# Altium schematic sheet 02_ RF & Power.SchDoc: EFR32FG28 Diversity Board with discrete matching network for 868/915 MHz
size 420 x 297 mm; Doc: BRD4210C; OrgName: Silicon Labs; Page Number: 2; Page Title: RF & Power; Page Size: A3; Page Count: 4; Board Designer: MSZ; RevCode: A00; DsnPath: C:\Users\maszvobo\Downloads\BRD4210A-A01-schematic-dsn\BRD4210A.DSN; SchematicName: SCHEMATIC1; PageName: 02: RF & Power; PageSize: A3; TopSchematic: True
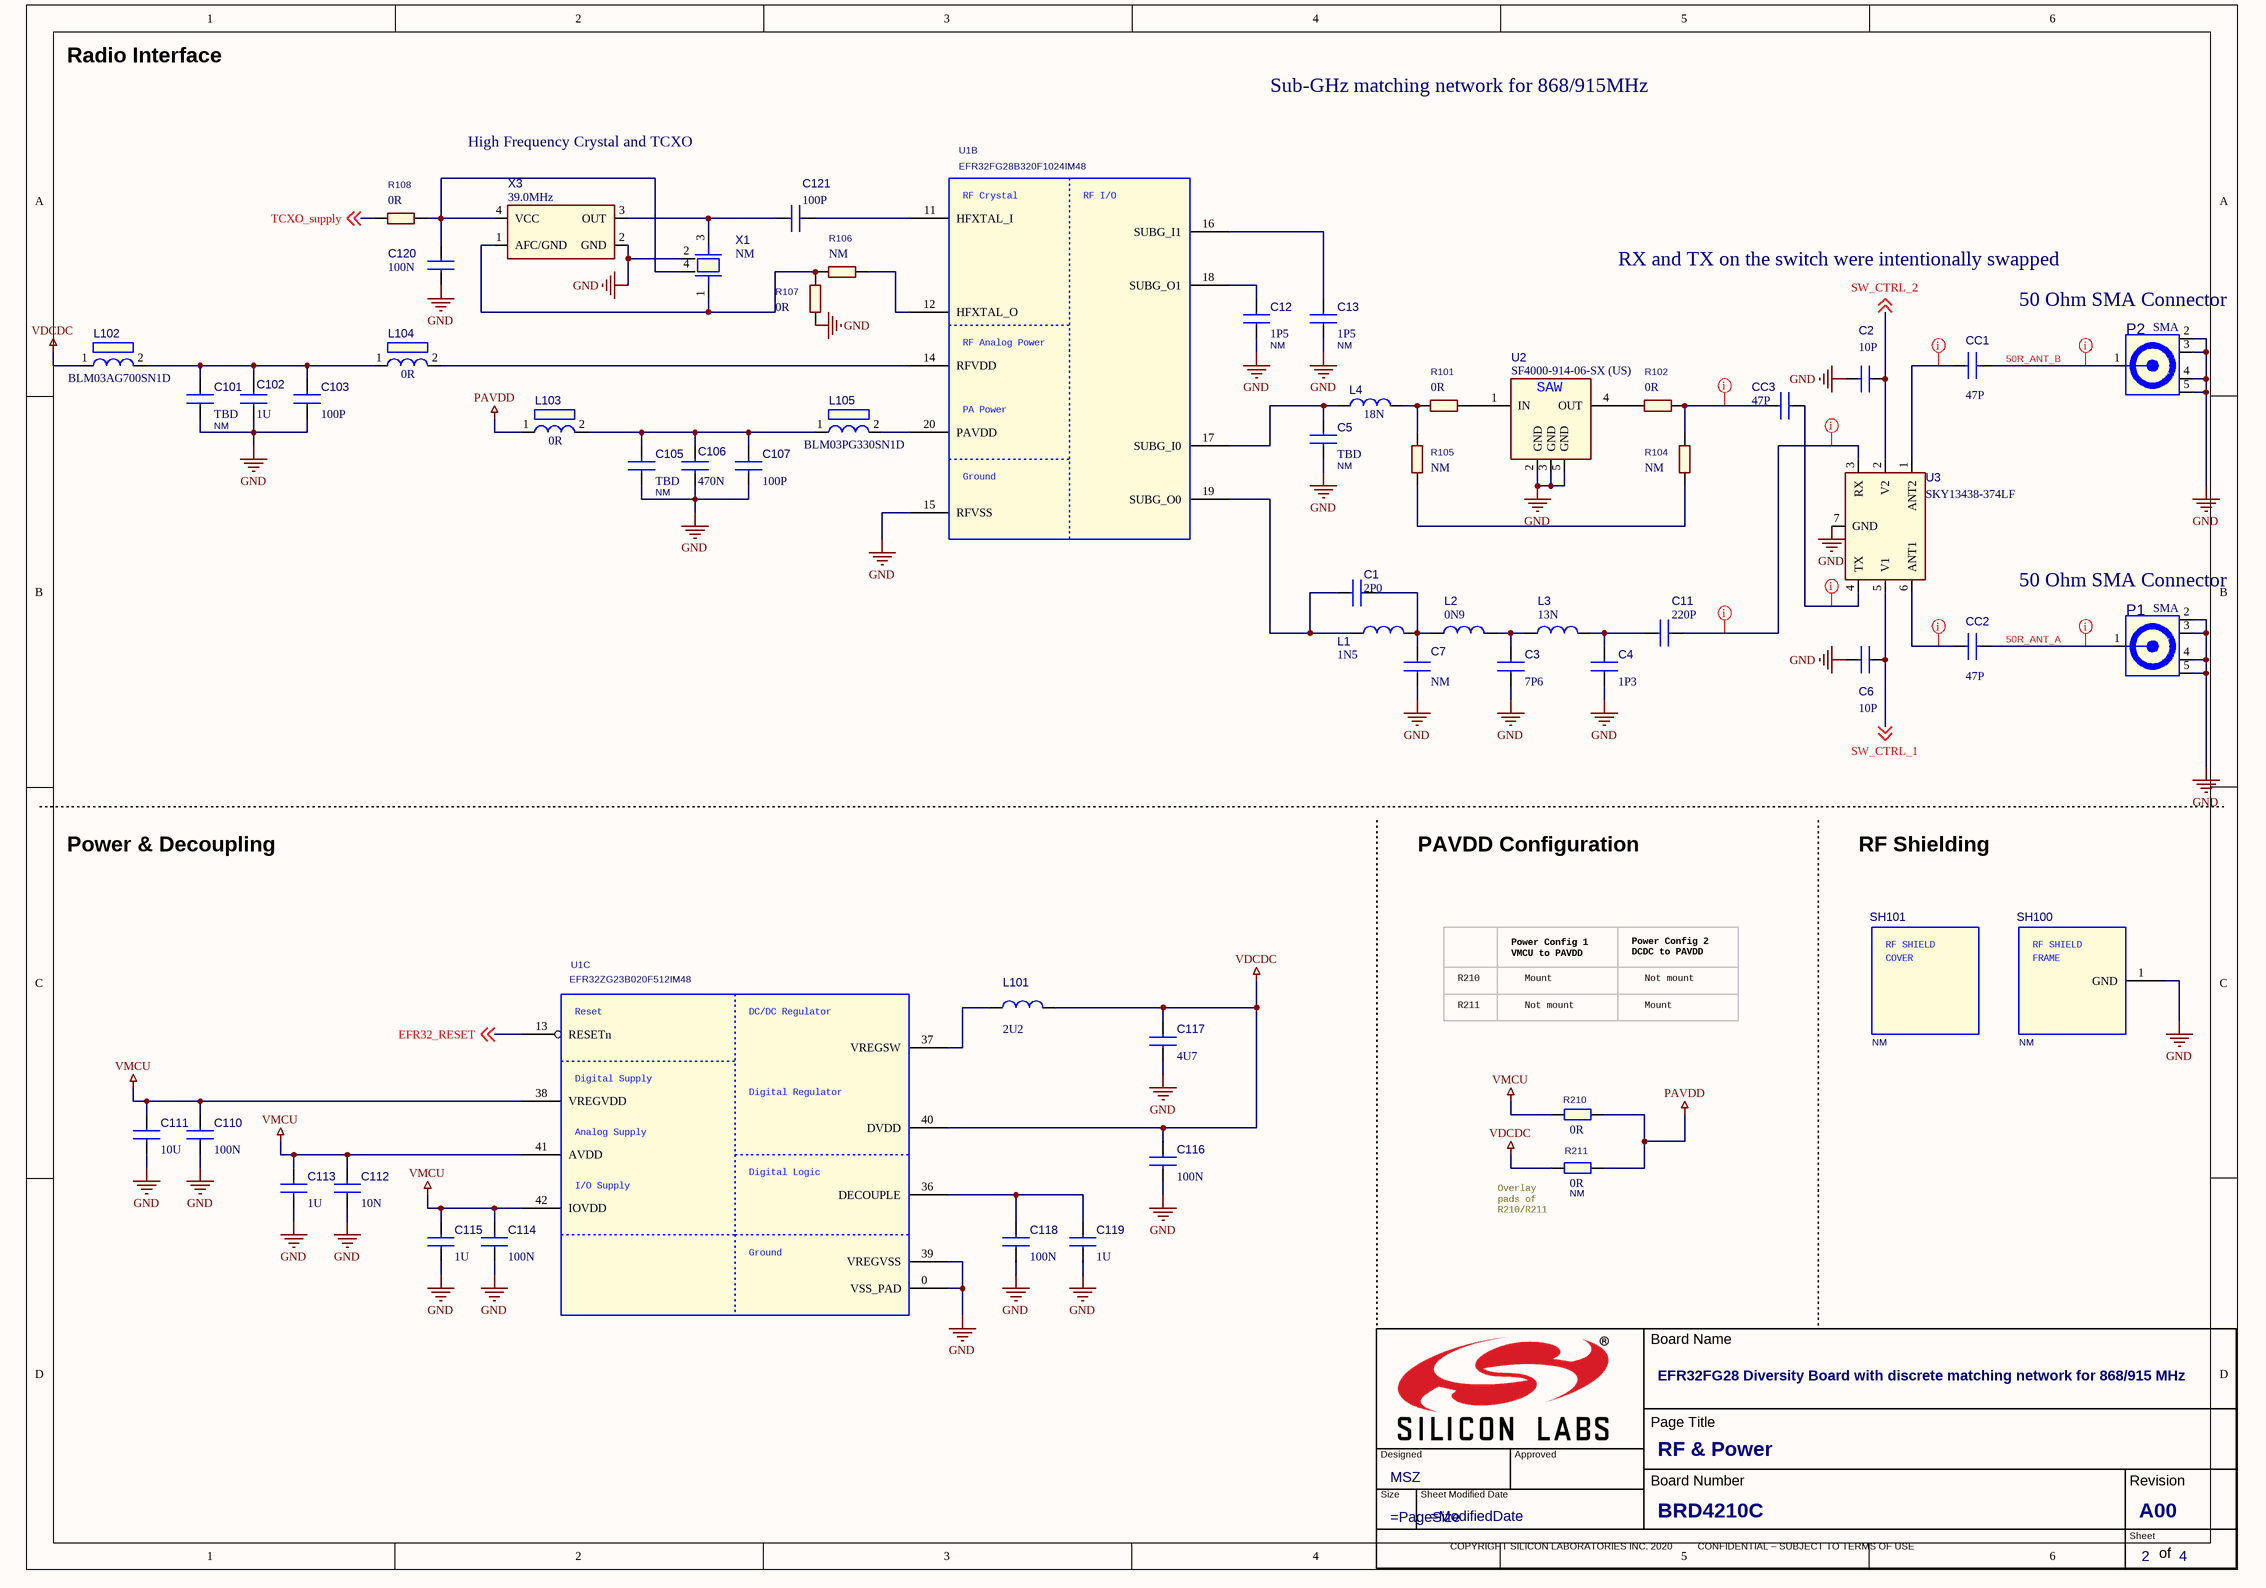
[diagram p0: 02_ RF & Power.SchDoc]

## Parts
*  Doc: BRD4210C  RevCode: A00  Board Designer: MSZ  Page Title: RF & Power  Page Number: 2  Page Count: 4  Title: EFR32FG28 Diversity Board with discrete matching network for 868/915 MHz  (graphical)
C1  2P0  [C0201_L]
C2  10P  [C0201_L]
C3  7P6  [C0201_L]
C4  1P3  [C0201_L]
C5  TBD  Not Mounted: NM  [C0201_L]
C6  10P  [C0201_L]
C7  NM  [C0201_L]
C11  220P  [C0201_L]
C12  1P5  Not Mounted: NM  [C0201_L]
C13  1P5  Not Mounted: NM  [C0201_L]
C101  TBD  Not Mounted: NM  [C0201_L]
C102  1U  [C0402_L]
C103  100P  [C0201_L]
C105  TBD  Not Mounted: NM  [C0201_L]
C106  470N  [C0402_L]
C107  100P  [C0201_L]
C110  100N  [C0201_L]
C111  10U  [C0603_L]
C112  10N  [C0201_L]
C113  1U  [C0402_L]
C114  100N  [C0201_L]
C115  1U  [C0402_L]
C116  100N  [C0201_L]
C117  4U7  [C0603_L]
C118  100N  [C0201_L]
C119  1U  [C0402_L]
C120  100N  [C0201_L]
C121  100P  [C0201_L]
CC1  47P  [C0201_L]
CC2  47P  [C0201_L]
CC3  47P  [C0201_L]
L1  1N5  [COIL_0201_L]
L2  0N9  [COIL_0201_L]
L3  13N  [COIL_0201_L]
L4  18N  [COIL_0201_L]
L101  2U2  [COIL_1008_L]
L102  BLM03AG700SN1D  [COIL_MUR_BLM03_0201]
L103  0R  [COIL_MUR_BLM03_0201]
L104  0R  [COIL_MUR_BLM03_0201]
L105  BLM03PG330SN1D  [COIL_MUR_BLM03_0201]
P1  SMA  [TE_SMA_1814832_TH_VER]
P2  SMA  [TE_SMA_1814832_TH_VER]
R101  0R  [R0201_L]
R102  0R  [R0201_L]
R104  NM  [R0201_L]
R105  NM  [R0201_L]
R106  NM  [R0201_L]
R107  0R  [R0201_L]
R108  0R  [R0201_L]
R210  0R  [R0402_L]
R211  0R  Not Mounted: NM  [R0402_L]
SH100  Not Mounted: NM  [Shield_21x21mm]  (hidden comment: RF_SHIELD_FRAME_36103205S)
SH101  Not Mounted: NM  (hidden comment: RF_SHIELD_COVER_36003200S)
U1  EFR32FG28B320F1024IM48  [QFN48_M040_6.0X6.0_EP_SL]  (parts B,C of 3)
U2  SF4000-914-06-SX (US)  [SF1256]
U3  SKY13438-374LF  [SKY13438-374LF]
X1  NM  [X_SSS_DSX211SH_2.05X1.65-4]
X3  39.0MHz  [TCXO_7Z-38.400MBG-T_SMD2016_TXC]

## Nets
GND: C2.1 C3.2 C4.2 C5.2 C6.1 C7.2 C12.2 C13.2 C101.2 C102.2 C103.2 C105.2 C106.2 C107.2 C110.2 C111.2 C112.2 C113.2 C114.2 C115.2 C116.2 C117.2 C118.2 C119.2 C120.2 P1.2(GND1) P1.3(GND2) P1.4(GND3) P1.5(GND4) P2.2(GND1) P2.3(GND2) P2.4(GND3) P2.5(GND4) R107.2 SH100.1(GND) U1.0(VSS_PAD) U1.15(RFVSS) U1.39(VREGVSS) U2.2(GND) U2.3(GND) U2.5(GND) U3.7(GND) X1.2 X3.2(GND)
PAVDD: L103.1 R210.1 R211.2
VDCDC: C116.1 C117.1 L101.2 L102.1 R211.1 U1.40(DVDD)
VMCU: C110.1 C111.1 C112.1 C113.1 C114.1 C115.1 R210.2 U1.38(VREGVDD) U1.41(AVDD) U1.42(IOVDD)
50R_ANT_A: CC2.2 P1.1(SIGNAL)
50R_ANT_B: CC1.2 P2.1(SIGNAL)
EFR32_RESET: U1.13(RESETn) ; off-sheet EFR32_RESET
SW_CTRL_1: C6.2 U3.5(V1) ; off-sheet SW_CTRL_1
SW_CTRL_2: C2.2 U3.2(V2) ; off-sheet SW_CTRL_2
TCXO_supply: R108.1 ; off-sheet TCXO_supply
NetC1_1: C1.1 L1.1 U1.19(SUBG_O0)
NetC1_2: C1.2 C7.1 L1.2 L2.1
NetC3_1: C3.1 L2.2 L3.1
NetC4_1: C4.1 C11.1 L3.2
NetC5_1: C5.1 L4.1 U1.17(SUBG_I0)
NetC11_2: C11.2 U3.3(RX)
NetC12_1: C12.1 U1.18(SUBG_O1)
NetC13_1: C13.1 U1.16(SUBG_I1)
NetC101_1: C101.1 C102.1 C103.1 L102.2 L104.1
NetC105_1: C105.1 C106.1 C107.1 L103.2 L105.1
NetC118_1: C118.1 C119.1 U1.36(DECOUPLE)
NetC120_1: C120.1 R108.2 X1.4 X3.4(VCC)
NetC121_1: C121.1 X1.3 X3.3(OUT)
NetC121_2: C121.2 U1.11(HFXTAL_I)
NetCC1_1: CC1.1 U3.1(ANT2)
NetCC2_1: CC2.1 U3.6(ANT1)
NetCC3_1: CC3.1 R102.2 R104.1
NetCC3_2: CC3.2 U3.4(TX)
NetL4_2: L4.2 R101.1 R105.1
NetL101_1: L101.1 U1.37(VREGSW)
NetL104_2: L104.2 U1.14(RFVDD)
NetL105_2: L105.2 U1.20(PAVDD)
NetR101_2: R101.2 U2.1(IN)
NetR102_1: R102.1 U2.4(OUT)
NetR104_2: R104.2 R105.2
NetR106_1: R106.1 R107.1 X1.1 X3.1(AFC/GND)
NetR106_2: R106.2 U1.12(HFXTAL_O)

## Layout directives
net class 50Ohm: 50R_ANT_A, 50R_ANT_B, NetC11_2, NetCC1_1, NetCC2_1, NetCC3_1, NetCC3_2

## Notes on the sheet
- Radio Interface
- Sub-GHz matching network for 868/915MHz
- High Frequency Crystal and TCXO
- RX and TX on the switch were intentionally swapped
- (near P2) 50 Ohm SMA Connector
- (near P1) 50 Ohm SMA Connector
- Power & Decoupling
- PAVDD Configuration
- RF Shielding
- R210
- Power Config 1
  VMCU to PAVDD
- Mount
- Power Config 2
  DCDC to PAVDD
- Not mount
- R211
- (near R211) Overlay
  pads of
  R210/R211
- (in symbol EFR32xG23_QFN48, part B) RF Crystal; RF I/O; RF Analog Power; PA Power; Ground
- (in symbol EFR32xG23_QFN48, part C) Reset; DC/DC Regulator; Digital Supply; Digital Regulator; Analog Supply; Digital Logic; I/O Supply; Ground
- (in symbol RF_SHIELD_COVER_36003200S) RF SHIELD; COVER
- (in symbol RF_SHIELD_FRAME_36103205S) RF SHIELD; FRAME
- (in symbol SF4000-914-06-SX) SAW
- (in symbol TitleBlock_SiliconLabs_A3) Board Name; Page Title; Designed; Approved; Board Number; Revision; Size; Sheet Modified Date; Sheet; COPYRIGHT SILICON LABORATORIES INC. 2020          CONFIDENTIAL – SUBJECT TO TERMS OF USE; of

## Library data of the parts
* = TitleBlock_SiliconLabs_A3: Page Size: =PageSize; Page Modify Date: =ModifiedDate; OrgName: Silicon Labs
C1 = C0201: Part Reference: C1; Mfg #: GRM0335C1H1R9BA01D; Mfg: Murata; Tolerance: ±0.1pF; Value: 1P9; Technology: C0G; PCB Footprint: C0201_L
C2 C6 CC1-CC3 = C0201: Part Reference: CC11; Tolerance: ±2%; Mfg: Murata; Mfg #: GJM0335C1E180GB01D; Technology: C0G; PCB Footprint: C0201_L
  C2 C6: Value: 10P
  CC1-CC3: Value: 47P
C3 = C0201: Part Reference: C3; Mfg #: GRM0335C1H7R2BA01D; Mfg: Murata; Tolerance: ±0.1pF; Value: 7P2; Technology: C0G; PCB Footprint: C0201_L
C4 = C0201: Part Reference: C4; Mfg #: GRM0335C1H1R3BA01D; Mfg: Murata; Tolerance: ±0.1pF; Technology: C0G; Value: 1P3; PCB Footprint: C0201_L
C5 = C0201: Part Reference: C5; Value: TBD; PCB Footprint: C0201_L
C7 = C0201: Part Reference: C1; Mfg #: GRM0335C1H1R9BA01D; Mfg: Murata; Tolerance: ±0.1pF; Technology: C0G; Value: NM; PCB Footprint: C0201_L
C11 = C0201: Part Reference: C11; Mfg #: GRM0335C1H221GA01D; Mfg: Murata; Tolerance: ±2%; Technology: C0G; Value: 220P; PCB Footprint: C0201_L
C12 = C0201: Part Reference: C12; Mfg #: GRM0335C1E1R5WA01D; Mfg: Murata; Tolerance: ±0.05pF; Technology: C0G; Value: 1P5; PCB Footprint: C0201_L
C13 C120 C121 = C0201: Part Reference: C13; Mfg #: GRM0335C1E1R5WA01D; Mfg: Murata; Tolerance: ±0.05pF; Technology: C0G; PCB Footprint: C0201_L
  C13: Value: 1P5
  C120: Value: 100N
  C121: Value: 100P
C101 = C0201: Part Reference: C101; Tolerance: +/-0.05P; Rating: 50V; Technology: C0G; Value: TBD; PCB Footprint: C0201_L
C102 = C0402: Part Reference: C102; Tolerance: 10%; Rating: 6.3V; Technology: X7R; Value: 1U; PCB Footprint: C0402_L
C103 = C0201: Part Reference: C103; Tolerance: 5%; Rating: 25V; Technology: C0G; Value: 100P; PCB Footprint: C0201_L
C105 = C0201: Part Reference: C105; Tolerance: +/-0.05P; Rating: 50V; Technology: C0G; Value: TBD; PCB Footprint: C0201_L
C106 = C0402: Part Reference: C106; Tolerance: 10%; Rating: 10V; Technology: X7R; Value: 470N; PCB Footprint: C0402_L
C107 = C0201: Part Reference: C107; Tolerance: 5%; Rating: 25V; Technology: C0G; Value: 100P; PCB Footprint: C0201_L
C110 = C0201: Part Reference: C110; Tolerance: 20%; Rating: 16V; Technology: X7S; Value: 100N; PCB Footprint: C0201_L
C111 = C0603: Part Reference: C111; Tolerance: 10%; Rating: 25V; Technology: X5R; Value: 10U; PCB Footprint: C0603_L
C112 = C0201: Part Reference: C112; Tolerance: 10%; Rating: 16V; Technology: X7S; Value: 10N; PCB Footprint: C0201_L
C113 = C0402: Part Reference: C113; Tolerance: 10%; Rating: 6.3V; Technology: X7R; Value: 1U; PCB Footprint: C0402_L
C114 = C0201: Part Reference: C114; Tolerance: 20%; Rating: 16V; Technology: X7S; Value: 100N; PCB Footprint: C0201_L
C115 = C0402: Part Reference: C115; Tolerance: 10%; Rating: 6.3V; Technology: X7R; Value: 1U; PCB Footprint: C0402_L
C116 = C0201: Part Reference: C116; Tolerance: 20%; Rating: 16V; Technology: X7S; Value: 100N; PCB Footprint: C0201_L
C117 = C0603: Part Reference: C117; Tolerance: 10%; Rating: 6.3V; Technology: X7R; Value: 4U7; PCB Footprint: C0603_L
C118 = C0201: Part Reference: C118; Tolerance: 20%; Rating: 16V; Technology: X7S; Value: 100N; PCB Footprint: C0201_L
C119 = C0402: Part Reference: C119; Tolerance: 10%; Rating: 6.3V; Technology: X7R; Value: 1U; PCB Footprint: C0402_L
L1 = L0201: Part Reference: L1; Mfg: Murata; Mfg #: LQP03HQ1N5W02D; Tolerance: ±0.05nH; Value: 1N5; PCB Footprint: COIL_0201_L
L2 = L0201: Part Reference: L2; Mfg: Murata; Mfg #: LQP03HQ1N3W02D; Tolerance: ±0.05nH; Value: 1N3; PCB Footprint: COIL_0201_L
L3 = L0201: Part Reference: L3; Mfg: Murata; Mfg #: LQP03HQ13NH02D; Tolerance: ±3%; Value: 13N; PCB Footprint: COIL_0201_L
L4 = L0201: Part Reference: L4; Mfg: Murata; Mfg #: LQP03HQ18NH02D; Tolerance: ±3%; Value: 18N; PCB Footprint: COIL_0201_L
L101 = L1008: Part Reference: L101; Tolerance: +/-20%; Mfg #: DFE2HCAH2R2MJ0L; Mfg: Murata; Value: 2U2; PCB Footprint: COIL_1008_L
L102 = BLM03AX: Part Reference: L102; Mfg: Murata; Mfg #: BLM03AG700SN1D; Price_1K: 0.05; Value: BLM03AG700SN1D; PCB Footprint: COIL_MUR_BLM03_0201
L103 = BLM03AX: Part Reference: L103; Price_1K: 0.05; Value: 0R; PCB Footprint: COIL_MUR_BLM03_0201
L104 = BLM03AX: Part Reference: L104; Price_1K: 0.05; Value: 0R; PCB Footprint: COIL_MUR_BLM03_0201
L105 = BLM03AX: Part Reference: L105; Mfg: Murata; Mfg #: BLM03PG330SN1D; Price_1K: 0.05; Value: BLM03PG330SN1D; PCB Footprint: COIL_MUR_BLM03_0201
P1 P2 = SMA_TH_WELLSHOW: Part Reference: P1; Mfg #: C02AN31P00101; Price_1K: 1.46; Mfg: Wellshow; Value: SMA; PCB Footprint: TE_SMA_1814832_TH_VER
R101 R102 R106-R108 = R0201: Price_1K: 0.005
  R101 R102 R107 R108: Value: 0R
  R106: Value: NM
R104 R105 = R0201: Not Mounted: NM; Price_1K: 0.005; Value: NM
R210 = R0402: Part Reference: R210; Price_1K: 0.005; Value: 0R; PCB Footprint: R0402_L
R211 = R0402: Part Reference: R211; Price_1K: 0.005; Value: 0R; PCB Footprint: R0402_L
SH100 = RF_SHIELD_FRAME_36103205S: Part Reference: SH100; Mfg: Würth Elektronik; Mfg #: 36103205S; Price_1k: 1.00; Value: RF_SHIELD_FRAME_36103205S; PCB Footprint: Shield_21x21mm
SH101 = RF_SHIELD_COVER_36003200S: Part Reference: SH101; Mfg: Würth Elektronik; Mfg #: 36003200S; Price_1k: 0.944; Value: RF_SHIELD_COVER_36003200S
U1 = EFR32xG23_QFN48: Part Reference: U1; MFG: Silicon Labs; MFG #: EFR32ZG23B020F512IM48-CR; Value: EFR32FG28B320F1024IM48; PCB Footprint: QFN48_M040_6.0X6.0_EP_SL
U2 = SF4000-914-06-SX: B2645 from Qualcomm also fits; Mfg: ACTE; Mfg #: SF4000-914-06-SX; Value: SF4000-914-06-SX (US)
U3 = SKY13438-374LF: Mfg #: BGS12WN6E6327XTSA1; Mfg: Infineon; Value: SKY13438-374LF
X1 = DSX211SH: Part Reference: X1; Mfg #: TZ3541C; Mfg: Tai-Saw; Value: 39.000 MHz; PCB Footprint: KDS_DSX211SH_2016; Price_1K: 0.512
X3 = 7Z-38.400MBG-T: Part Reference: X1; Mfg: TXC; Mfg #: 7Z-38.400MBG-T